# Altium schematic sheet Shematic.SchDoc
size 350 x 250 mm
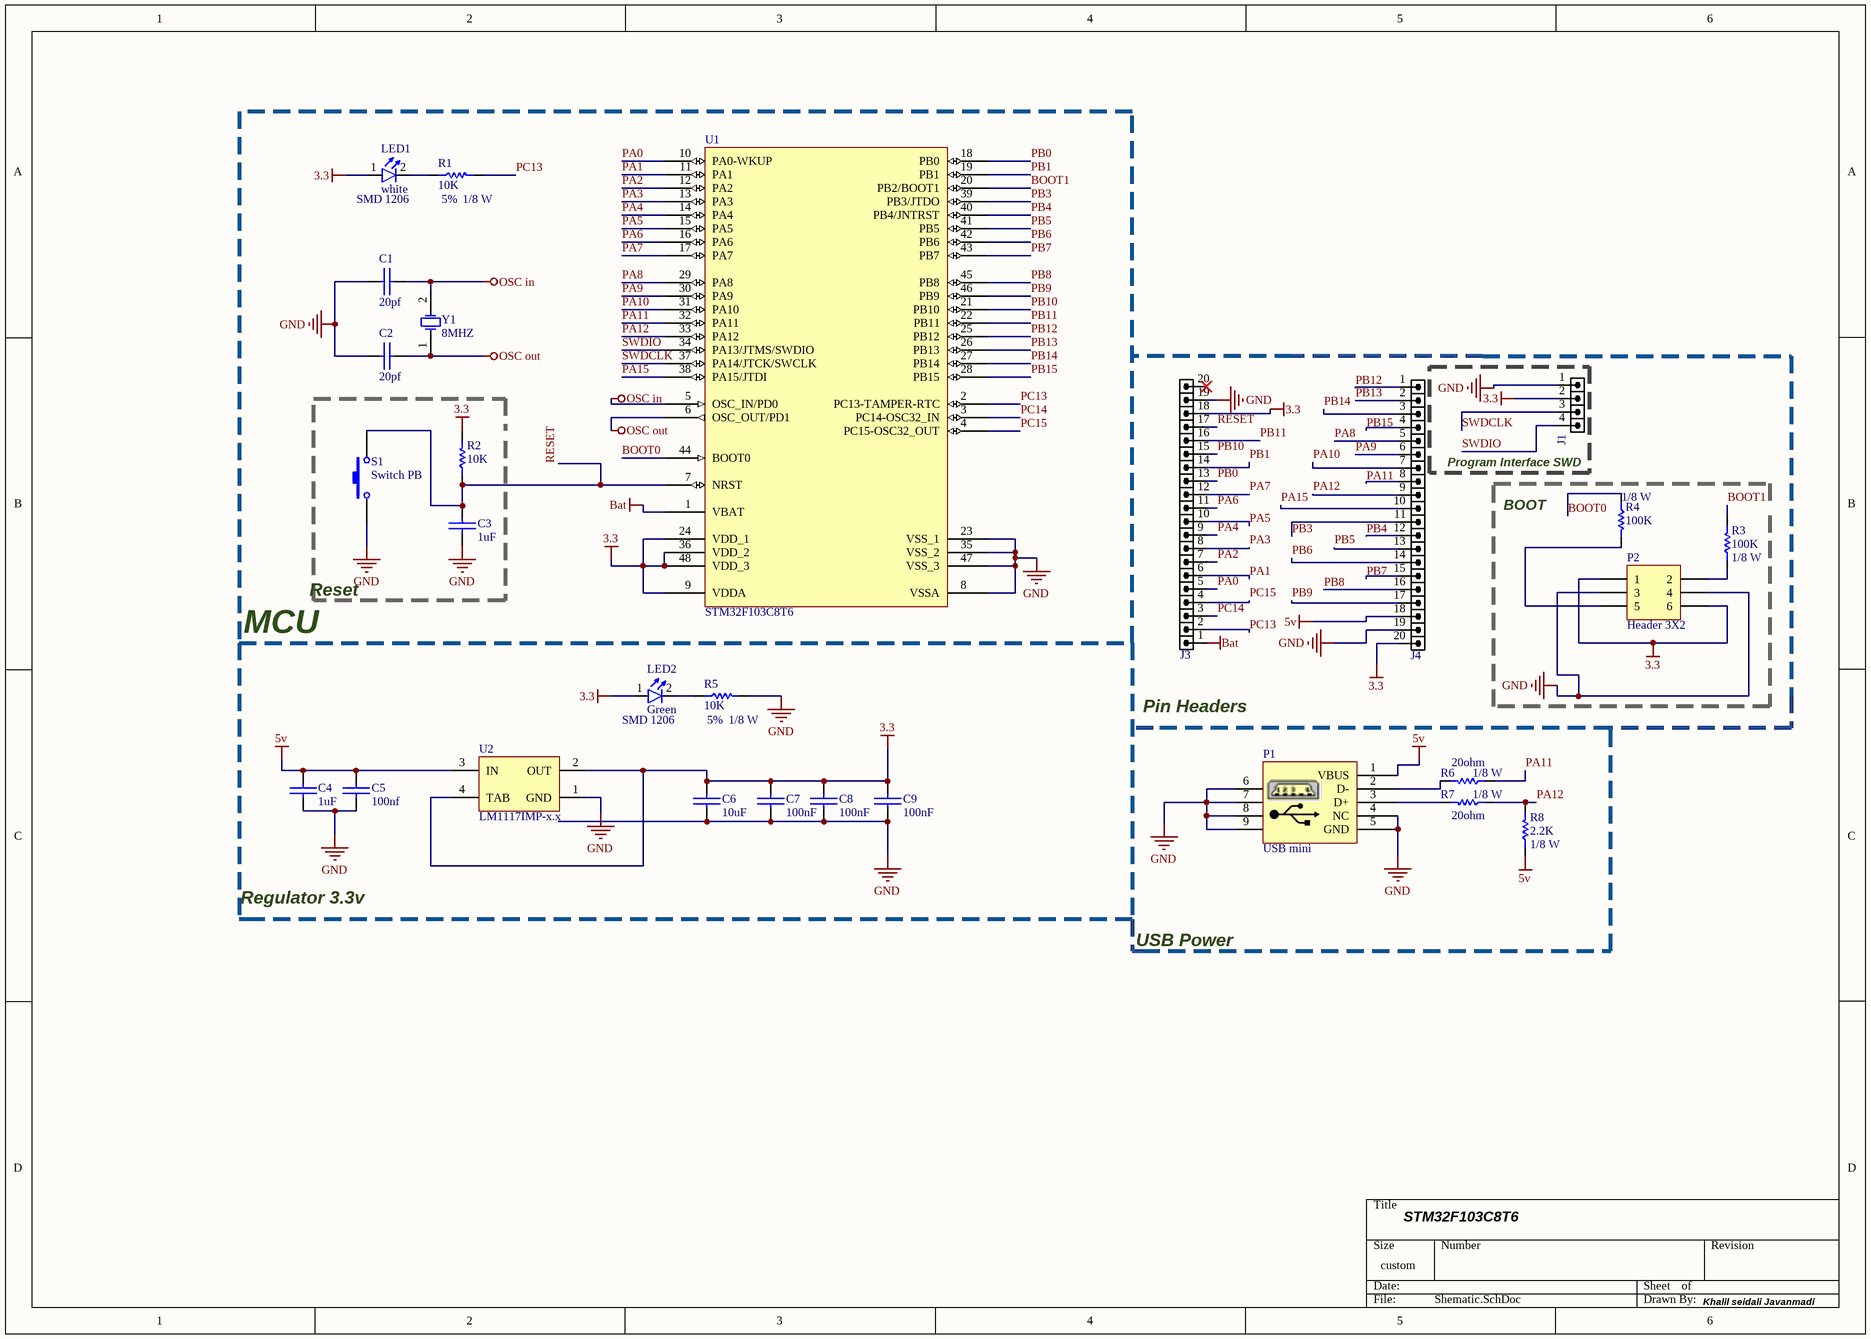
[diagram p0: Shematic.SchDoc]

## Parts
C1  20pf  [SMD_CAP_0805]
C2  20pf  [SMD_CAP_0805]
C3  1uF  [SMD_CAP_0805]
C4  1uF  [SMD_CAP_0805]
C5  100nf  [SMD_CAP_0805]
C6  10uF  [SMD_CAP_0805]
C7  100nF  [SMD_CAP_0805]
C8  100nF  [SMD_CAP_0805]
C9  100nF  [SMD_CAP_0805]
J1  HDR1X4  [HDR_M_1X4]  (value not drawn)
J3  HDR1X20  [HDR_M_1X20]  (value not drawn)
J4  HDR1X20  [HDR_M_1X20]  (value not drawn)
LED1  Size: SMD 1206  [LED SMD 1206]  (hidden comment: white)
LED2  Size: SMD 1206  [LED SMD 1206]  (hidden comment: Green)
P1  USB mini  [SMD_Mini USB Connector]
P2  Header 3X2  [HDR2X3]
R1  Tolerance: 5%  Power: 1/8 W  [RES 0805 (2012X06L)]  (hidden comment: 10K)
R2  10K  [RES 0805 (2012X06L)]
R3  Power: 1/8 W  [RES 0805 (2012X06L)]  (hidden comment: 100K)
R4  Power: 1/8 W  [RES 0805 (2012X06L)]  (hidden comment: 100K)
R5  Tolerance: 5%  Power: 1/8 W  [RES 0805 (2012X06L)]  (hidden comment: 10K)
R6  Power: 1/8 W  [RES 0805 (2012X06L)]  (hidden comment: 20ohm)
R7  Power: 1/8 W  [RES 0805 (2012X06L)]  (hidden comment: 20ohm)
R8  Power: 1/8 W  [RES 0805 (2012X06L)]  (hidden comment: 2.2K)
S1  Switch PB  [SW-PB]
U1  STM32F103C8T6  [LQFP48_L]
U2  LM1117IMP-x.x  [MP04A_N]
Y1  8MHZ  [Crystal SMD]

## Blocks framed on the sheet
MCU: C1-C3 LED1 R1 R2 S1 U1 Y1
Program Interface SWD: J1

## Nets
3.3: C6.1(+) C7.1(+) C8.1(+) C9.1(+) J1.2 J3.18 J4.20 LED1.1(A) LED2.1(A) P2.1 P2.6 R2.2 U1.9(VDDA) U1.24(VDD_1) U1.36(VDD_2) U1.48(VDD_3) U2.2(OUT) U2.4(TAB)
5v: C4.1(+) C5.1(+) J4.18 P1.1(VBUS) R8.1 U2.3(IN)
Bat: J3.1 U1.1(VBAT)
GND: C1.1(+) C2.1(+) C3.2(-) C4.2(-) C5.2(-) C6.2(-) C7.2(-) C8.2(-) C9.2(-) J1.1 J3.19 J4.19 P1.4(NC) P1.5(GND) P1.6 P1.7 P1.8 P1.9 P2.3 P2.4 R5.2 S1.1 U1.8(VSSA) U1.23(VSS_1) U1.35(VSS_2) U1.47(VSS_3) U2.1(GND)
OSC in: C1.2(-) U1.5(OSC_IN/PD0) Y1.2(OSC2)
OSC out: C2.2(-) U1.6(OSC_OUT/PD1) Y1.1(OSC1)
BOOT0: R4.1 U1.44(BOOT0)
BOOT1: R3.2 U1.20(PB2/BOOT1)
PA0: J3.5 U1.10(PA0-WKUP)
PA1: J3.6 U1.11(PA1)
PA2: J3.7 U1.12(PA2)
PA3: J3.8 U1.13(PA3)
PA4: J3.9 U1.14(PA4)
PA5: J3.10 U1.15(PA5)
PA6: J3.11 U1.16(PA6)
PA7: J3.12 U1.17(PA7)
PA8: J4.5 U1.29(PA8)
PA9: J4.6 U1.30(PA9)
PA10: J4.7 U1.31(PA10)
PA11: J4.8 R6.1 U1.32(PA11)
PA12: J4.9 R7.1 R8.2 U1.33(PA12)
PA15: J4.10 U1.38(PA15/JTDI)
PB0: J3.13 U1.18(PB0)
PB1: J3.14 U1.19(PB1)
PB3: J4.11 U1.39(PB3/JTDO)
PB4: J4.12 U1.40(PB4/JNTRST)
PB5: J4.13 U1.41(PB5)
PB6: J4.14 U1.42(PB6)
PB7: J4.15 U1.43(PB7)
PB8: J4.16 U1.45(PB8)
PB9: J4.17 U1.46(PB9)
PB10: J3.15 U1.21(PB10)
PB11: J3.16 U1.22(PB11)
PB12: J4.1 U1.25(PB12)
PB13: J4.2 U1.26(PB13)
PB14: J4.3 U1.27(PB14)
PB15: J4.4 U1.28(PB15)
PC13: J3.2 R1.2 U1.2(PC13-TAMPER-RTC)
PC14: J3.3 U1.3(PC14-OSC32_IN)
PC15: J3.4 U1.4(PC15-OSC32_OUT)
RESET: C3.1(+) J3.17 R2.1 S1.2 U1.7(NRST)
SWDCLK: J1.3 U1.37(PA14/JTCK/SWCLK)
SWDIO: J1.4 U1.34(PA13/JTMS/SWDIO)
NetLED1_2: LED1.2(K) R1.1
NetLED2_2: LED2.2(K) R5.1
NetP1_2: P1.2(D-) R6.2
NetP1_3: P1.3(D+) R7.2
NetP2_2: P2.2 R3.1
NetP2_5: P2.5 R4.2

Not connected (* = marked no-connect by the designer): J3 20*

## Notes on the sheet
- BOOT
- Reset
- Pin Headers
- Regulator 3.3v
- USB Power
- STM32F103C8T6
- Khalil seidali Javanmadi

## Library data of the parts
C1-C9 = Cap-Bipolar: Bipolar Capacitor; Voltage: 100V; Designer: Saeid Jorablo; Organazation: ControTec; Adding Date: 1387/12/20
  C1 C2: Value: 20pf
  C3 C4: Value: 1uF
  C5: Value: 100nf
  C6: Value: 10uF
  C7-C9: Value: 100nF
J1 = HDR_M_1X4: CONN, HEADER, Male, pitch: 2.54mm, 4POS; VALUE: HDRM4
J3 J4 = HDR_M_1X20: CONN, HEADER, Male, pitch: 2.54mm, 20POS; VALUE: HDRM20
LED1 LED2 = LED: Designer: Saeid Jorablo; Organazation: ControTec; Adding Date: 1387/12/22
  LED1: Color: white
  LED2: Color: Green
P1 = USB mini: mini USB Connector
P2 = Header 3X2: Header, 3-Pin, Dual row; LatestRevisionDate: 17-Jul-2002; LatestRevisionNote: Re-released for DXP Platform.; Publisher: Altium Limited
R1-R8 = Resistor
  R1 R2 R5: Value: 10K
  R3 R4: Value: 100K
  R6 R7: Value: 20ohm
  R8: Value: 2.2K
S1 = Switch PB: Push Button Switch
U1 = STM32F103C8T6: STM32 ARM-based 32-bit MCU with 64 Kbytes Flash, 48-pin LQFP, Industrial Temperature; Published: 30-May-2008; DatasheetVersion: rev6, Mar-2008; PackageVersion: Mar-2008; PackageReference: LQFP48; Publisher: Altium Limited; PackageDescription: 48-Pin Low-Profile Quad Flat Pack, 7 x 7 mm Body, 0.5 mm Pitch (LQFP48); ComponentLink1Description: Manufacturer Link; ComponentLink1URL: www.st.com/stm32; ComponentLink2Description: Datasheet; ComponentLink2URL: http://www.st.com/stonline/products/literature/ds/13587.pdf
U2 = LM1117IMP-x.x: x.x Volt, 800mA Low-Dropout Linear Regulator, 4-pin SOT-223; PartNumber: LM1117IMP-3.3; Manufacturer: National Semiconductor; PackageTopMarking: XYTT*N05B; PowerWise: N; CompType: LDO IC; Published: 4-Dec-2008; DatasheetVersion: Apr-2006; PackageVersion: revB, Apr-2003; PackageReference: MP04A; Publisher: Altium Limited; PackageDescription: Molded SOT-223, 6.50 x 3.56 x 1.6mm Body, 4 Lead, 2.3mm Pitch; Supplier 1: Farnell; Supplier Part Number 1: 7614123; RoHS: N; PinCount: 4; Code_JEDEC: TO-261-AA; Code_IPC: SOT223-4; ComponentLink1Description: LM1117 Datasheet; ComponentLink1URL: http://www.national.com/ds/LM/LM1117.pdf; ComponentLink2Description: LM1117 Web Page; ComponentLink2URL: http://www.national.com/pf/LM/LM1117.html; ComponentLink3Description: MP04A Package Page; ComponentLink3URL: http://www.national.com/packaging/folders/mp04a.html
Y1 = XTAL: XTAL Crystal; Company: E.P.I.L; Design Date: 11/04/2011; Value: 8MHZ